# Altium schematic sheet Knot_Thing_nRF.SchDoc: KNoT Thing DevBoard NRF
size A4; Organization: C.E.S.A.R; Address1: Rua Bione, 220; Address2: Bairro do Recife; Address3: Recife - PE - Brasil; Address4: 50030-390; DocumentNumber: 1; Revision: 1; SheetNumber: 3; SheetTotal: 3
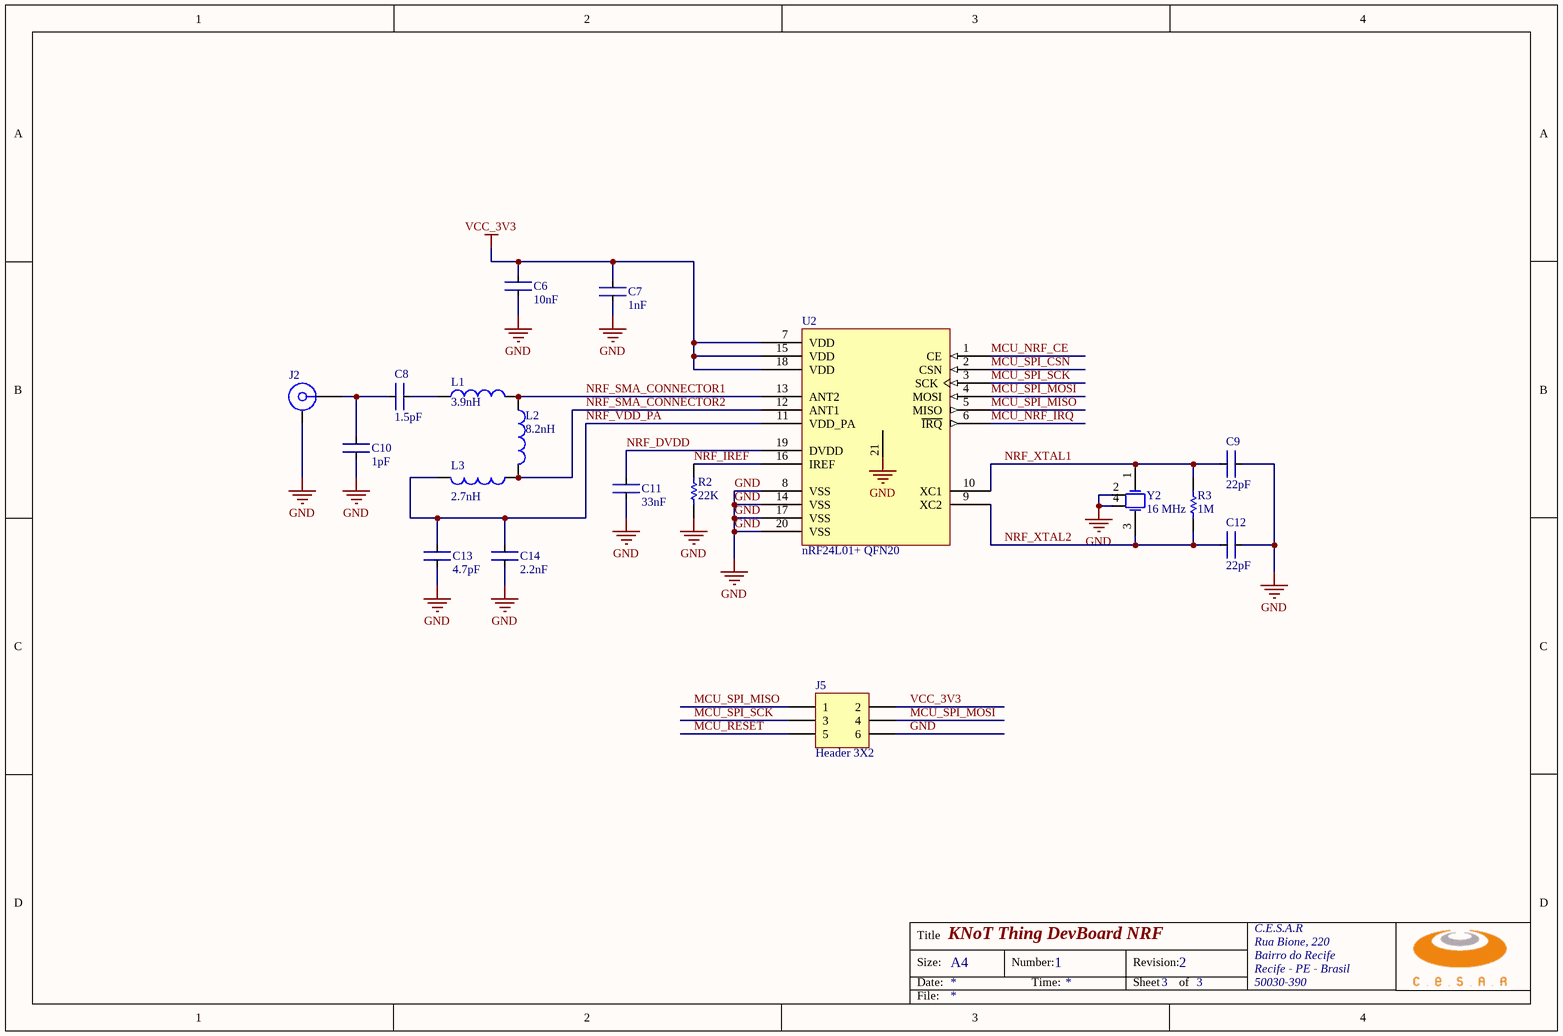
[diagram p0: Knot_Thing_nRF.SchDoc]

## Parts
C6  value 10nF  [CAPC1005L]  (hidden comment: Cap_0402)
C7  value 1nF  [CAPC1005L]  (hidden comment: Cap_0402)
C8  value 1.5pF  [CAPC1005L]  (hidden comment: Cap_0402)
C9  value 22pF  [CAPC1005L]  (hidden comment: Cap_0402)
C10  value 1pF  [CAPC1005L]  (hidden comment: Cap_0402)
C11  value 33nF  [CAPC1005L]  (hidden comment: Cap_0402)
C12  value 22pF  [CAPC1005L]  (hidden comment: Cap_0402)
C13  value 4.7pF  [CAPC1005L]  (hidden comment: Cap_0402)
C14  value 2.2nF  [CAPC1005L]  (hidden comment: Cap_0402)
J2  32K249-400L5  [ROS-32K249-400L5_V]  (value not drawn)
J5  Header 3X2  [HDR2X3]
L1  Inductor0402  [CAPC1005L]  (value not drawn)
L2  Inductor0402  [CAPC1005L]  (value not drawn)
L3  Inductor0402  [CAPC1005L]  (value not drawn)
R2  value 22K  [CAPC1005L]  (hidden comment: RES_0402)
R3  value 1M  [CAPC1005L]  (hidden comment: RES_0402)
U2  nRF24L01+ QFN20  [QFN20]
Y2  16 MHz  [SPK-16M-5032]

## Nets
GND: C6.1 C7.1 C9.1 C10.1 C11.1 C12.2 C13.1 C14.1 J2.MH J5.6 R2.1 U2.8(VSS) U2.14(VSS) U2.17(VSS) U2.20(VSS) U2.21 Y2.2 Y2.4
VCC_3V3: C6.2 C7.2 J5.2 U2.7(VDD) U2.15(VDD) U2.18(VDD)
MCU_NRF_CE: U2.1(CE)
MCU_NRF_IRQ: U2.6(~{IRQ})
MCU_RESET: J5.5
MCU_SPI_CSN: U2.2(CSN)
MCU_SPI_MISO: J5.1 U2.5(MISO)
MCU_SPI_MOSI: J5.4 U2.4(MOSI)
MCU_SPI_SCK: J5.3 U2.3(SCK)
NRF_DVDD: C11.2 U2.19(DVDD)
NRF_IREF: R2.2 U2.16(IREF)
NRF_SMA_CONNECTOR1: L1.2 L2.1 U2.13(ANT2)
NRF_SMA_CONNECTOR2: L2.2 L3.1 U2.12(ANT1)
NRF_VDD_PA: C13.2 C14.2 L3.2 U2.11(VDD_PA)
NRF_XTAL1: C9.2 R3.1 U2.10(XC1) Y2.1(OSC1)
NRF_XTAL2: C12.1 R3.2 U2.9(XC2) Y2.3(OSC2)
NetC8_1: C8.1 C10.2 J2.1
NetC8_2: C8.2 L1.1

## Notes on the sheet
- Title
- Size:
- Date:
- A4
- Number:
- Time:
- Revision:
- Sheet
- 2
- of
- File:
- (in symbol Inductor0402) 3.9nH; 8.2nH; 2.7nH

## Library data of the parts
C6-C14 = Capacitor_0402: Chip Capacitor 0402 (1005 metric); Supplier 1: Digi-Key
  C6: Supplier Part Number 1: 311-1703-1-ND
  C7: Supplier Part Number 1: 311-1352-1-ND
  C8: Supplier Part Number 1: 311-1003-1-ND
  C9 C12: Supplier Part Number 1: 311-1018-1-ND
  C10: Supplier Part Number 1: 311-2076-1-ND
  C11: Supplier Part Number 1: 311-1704-1-ND
  C13: Supplier Part Number 1: 311-1367-1-ND
  C14: Supplier Part Number 1: 311-1707-1-ND
J2 = 32K249-400L5: SMA Right Angle Jack, Up to 18 GHz, -65 to 165 degC; Design Note: Footprint in library is a generic example - only application specific footprint delivers High Performance; DatasheetVersion: b00; PackageVersion: b00; PackageReference: 32K249-400L5; PackageDescription: SMA Right Angle Jack, 14.8 x 6.35 x 9.7 mm; Mounting Technology: Through Hole; PartNumber: 32K249-400L5; ComponentLink1Description: Manufacturer URL; ComponentLink1URL: http://www.rosenberger.de; ComponentLink2Description: Datasheet; ComponentLink2URL: http://rosenberger.de/ok/images/documents/db/32K249-400L5.pdf; ComponentLink3Description: Package Specification; ComponentLink3URL: http://rosenberger.de/ok/images/documents/db/32K249-400L5.pdf; ComponentLink4Description: Series Overview / Design Note; ComponentLink4URL: http://rosenberger.de/ok/images/documents/spez/32.pdf; ComponentLink5Description: Webshop / RFQ; ComponentLink5URL: http://www.rosenberger.com/en/contact/sales/; Supplier 1: Digi-Key; Supplier Part Number 1: ARFX1232-ND
J5 = Header 3X2: Header, 3-Pin, Dual row; LatestRevisionDate: 17-Jul-2002; LatestRevisionNote: Re-released for DXP Platform.; Publisher: Altium Limited
L1-L3 = Inductor0402: Inductor 27nH; Supplier 1: Digi-Key
  L1: Supplier Part Number 1: A103711CT-ND
  L2: Supplier Part Number 1: A102559CT-ND
  L3: Supplier Part Number 1: A103706CT-ND
R2 R3 = RES_0402: Precision Thick Film Chip Resistor, 10 Ohm to 1M Ohm Range, 1% and 0.5% Tolerance, 0805 Size, 1/8 W; Supplier 1: Digi-Key
  R2: Supplier Part Number 1: 311-22KJRCT-ND
  R3: Supplier Part Number 1: 311-1.0MJRCT-ND
U2 = nRF24L01+: IC RF TxRx Only General ISM > 1GHZ 2.4GHz; Supplier 1: Digi-Key; Supplier Part Number 1: 1490-1019-ND
Y2 = XTAL_SMD: Crystal FOXSLF/080-20; Supplier 1: Digi-Key; Supplier Part Number 1: 887-1708-1-ND